# Altium project Gateway_Environmental_Sensor.PrjPcb
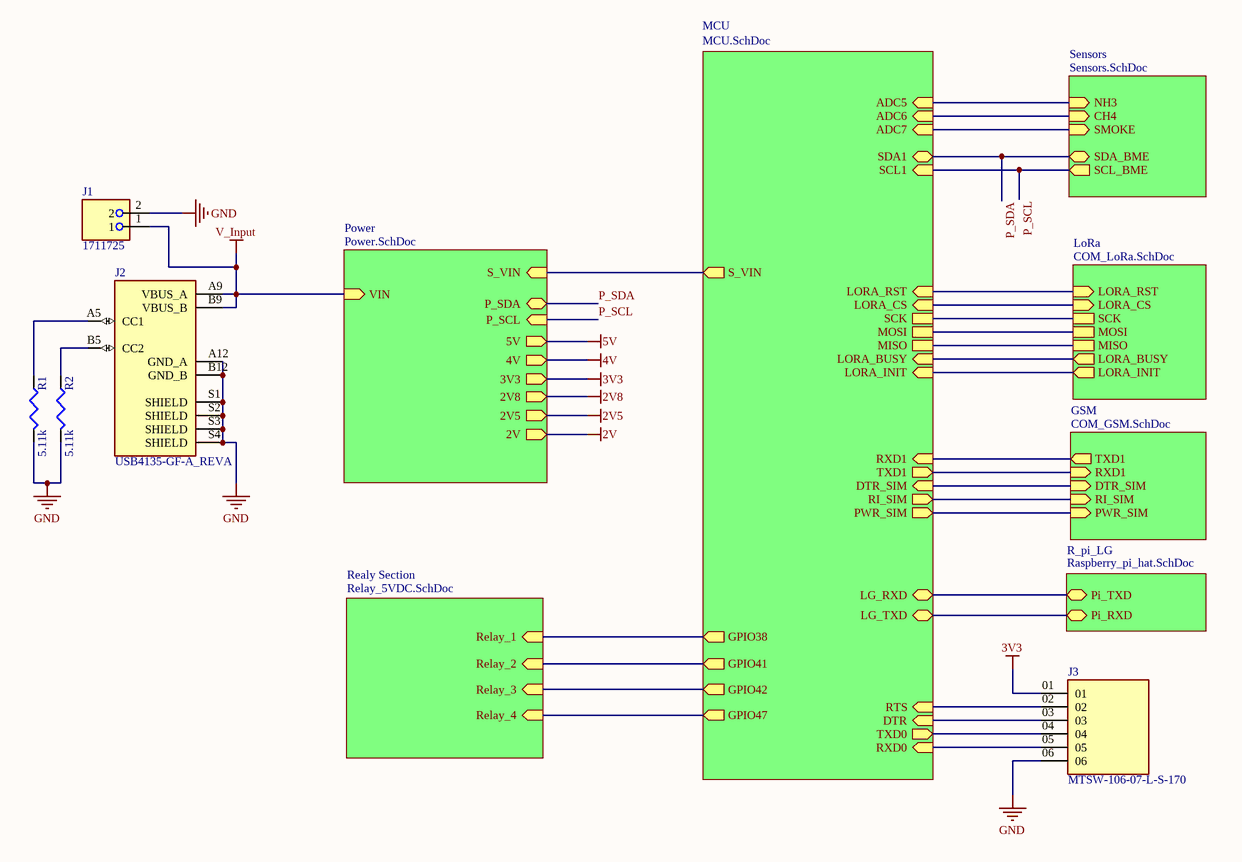
[diagram p0: TopSheet.SchDoc]
8 sheets, 147 parts. Net scope: hierarchical (ports join the sheet entries above them; power ports are global).
Board file: PCB1.PcbDoc
Sheets:
  TopSheet.SchDoc
    MCU = MCU.SchDoc
    Power = Power.SchDoc
    Sensors = Sensors.SchDoc
    LoRa = COM_LoRa.SchDoc
    GSM = COM_GSM.SchDoc
    R_pi_LG = Raspberry_pi_hat.SchDoc
    Realy Section = Relay_5VDC.SchDoc

## Sheet TopSheet.SchDoc
size 279 x 241 mm; SheetNumber: 1; SheetTotal: 8

### Parts
J1  1711725  [PHOENIX_1711725]
J2  USB4135-GF-A_REVA  [GCT_USB4135-GF-A_REVA]
J3  MTSW-106-07-L-S-170  [SAMTEC_MTSW-106-07-L-S-170]
R1  5.11k  [R0603]
R2  5.11k  [R0603]

### Sub-sheets
GSM = COM_GSM.SchDoc: TXD1 (out), RXD1 (in), DTR_SIM (in), RI_SIM (in), PWR_SIM (in)
LoRa = COM_LoRa.SchDoc: LORA_RST (in), LORA_CS (in), SCK, MOSI, MISO, LORA_BUSY (out), LORA_INIT (out)
MCU = MCU.SchDoc: ADC5 (in), ADC6 (in), ADC7 (in), SDA1 (bidir), SCL1 (in), LORA_RST (in), LORA_CS (in), SCK, MOSI, MISO, LORA_BUSY (in), LORA_INIT (in), RXD1 (in), TXD1 (out), DTR_SIM (in), RI_SIM (out), PWR_SIM (out), RTS (in), DTR (in), TXD0 (out), RXD0 (in), S_VIN (out), LG_TXD (bidir), LG_RXD (bidir), GPIO38 (out), GPIO41 (out), GPIO42 (out), GPIO47 (out)
Power = Power.SchDoc: P_SDA (bidir), P_SCL (in), 5V (out), 3V3 (out), 2V5 (out), 4V (out), 2V8 (out), 2V (out), VIN (in), S_VIN (in)
R_pi_LG = Raspberry_pi_hat.SchDoc: Pi_RXD (bidir), Pi_TXD (bidir)
Realy Section = Relay_5VDC.SchDoc: Relay_1 (in), Relay_2 (in), Relay_3 (in), Relay_4 (in)
Sensors = Sensors.SchDoc: NH3 (in), CH4 (in), SMOKE (in), SDA_BME (bidir), SCL_BME (out)

### Nets
3V3: J3.01 ; sheet Power/3V3
GND: J1.2 J2.A12(GND_A) J2.B12(GND_B) J2.S1(SHIELD) J2.S2(SHIELD) J2.S3(SHIELD) J2.S4(SHIELD) J3.06 R1.2 R2.2
V_Input: J1.1 J2.A9(VBUS_A) J2.B9(VBUS_B) ; sheet Power/VIN
P.06: sheet MCU/DTR_SIM, sheet GSM/DTR_SIM
P.07: sheet MCU/RI_SIM, sheet GSM/RI_SIM
P_SCL: sheet MCU/SCL1, sheet Power/P_SCL, sheet Sensors/SCL_BME
P_SDA: sheet MCU/SDA1, sheet Power/P_SDA, sheet Sensors/SDA_BME
RXD: sheet MCU/TXD1, sheet GSM/RXD1
TXD: sheet MCU/RXD1, sheet GSM/TXD1
NetJ2_A5: J2.A5(CC1) R1.1
NetJ2_B5: J2.B5(CC2) R2.1
NetJ3_02: J3.02 ; sheet MCU/RTS
NetJ3_03: J3.03 ; sheet MCU/DTR
NetJ3_04: J3.04 ; sheet MCU/TXD0
NetJ3_05: J3.05 ; sheet MCU/RXD0
NetJ11_8: sheet MCU/LG_RXD, sheet R_pi_LG/Pi_TXD
NetJ11_10: sheet MCU/LG_TXD, sheet R_pi_LG/Pi_RXD
NetR12_1: sheet MCU/S_VIN, sheet Power/S_VIN
NetR21_1: sheet MCU/ADC5, sheet Sensors/NH3
NetR22_1: sheet MCU/ADC6, sheet Sensors/CH4
NetR23_1: sheet MCU/ADC7, sheet Sensors/SMOKE
NetR27_1: sheet MCU/PWR_SIM, sheet GSM/PWR_SIM
NetR37_1: sheet MCU/GPIO38, sheet Realy Section/Relay_1
NetR39_1: sheet MCU/GPIO41, sheet Realy Section/Relay_2
NetR43_1: sheet MCU/GPIO42, sheet Realy Section/Relay_3
NetR47_1: sheet MCU/GPIO47, sheet Realy Section/Relay_4
NetU1_4: sheet MCU/LORA_INIT, sheet LoRa/LORA_INIT
NetU1_15: sheet MCU/LORA_BUSY, sheet LoRa/LORA_BUSY
NetU1_18: sheet MCU/LORA_CS, sheet LoRa/LORA_CS
NetU1_19: sheet MCU/MOSI, sheet LoRa/MOSI
NetU1_20: sheet MCU/SCK, sheet LoRa/SCK
NetU1_21: sheet MCU/MISO, sheet LoRa/MISO
NetU1_22: sheet MCU/LORA_RST, sheet LoRa/LORA_RST

### Library data of the parts
J1 = 1711725: PCB Terminal Screw 5.08mm 12AWG 400V 24A 2 Position COMBICON MKDS Series | Phoenix Contact 1711725; SnapEDA_Link: https://www.snapeda.com/parts/1711725/Phoenix+Contact/view-part/?ref=snap; Package: None; MF: Phoenix Contact; MP: 1711725; Check_prices: https://www.snapeda.com/parts/1711725/Phoenix+Contact/view-part/?ref=eda
J2 = USB4135-GF-A_REVA: Type C Receptacle, Horizontal, SMT, For Power Charging Only; MF: Global Connector Technology; SnapEDA_Link: https://www.snapeda.com/parts/USB4135-GF-A/Global+Connector+Technology/view-part/?ref=snap; Check_prices: https://www.snapeda.com/parts/USB4135-GF-A/Global+Connector+Technology/view-part/?ref=eda; Price: None; MP: USB4135-GF-A; Value: *; Purchase-URL: https://pricing.snapeda.com/search/part/USB4135-GF-A/?ref=eda; Availability: In Stock; Package: None
R1 R2 = Resistor: This Library provides a comprehensive set of schematic symbols and PCB footprints for standard resistor packages (e.g., 0402, 0603, 0805, 1206).
J3 = MTSW-106-07-L-S-170: Availability: Unavailable; Package: None; Price: None; MP: MTSW-106-07-L-S-170

## Sheet MCU.SchDoc
size 355 x 203 mm; SheetNumber: 2; SheetTotal: 8
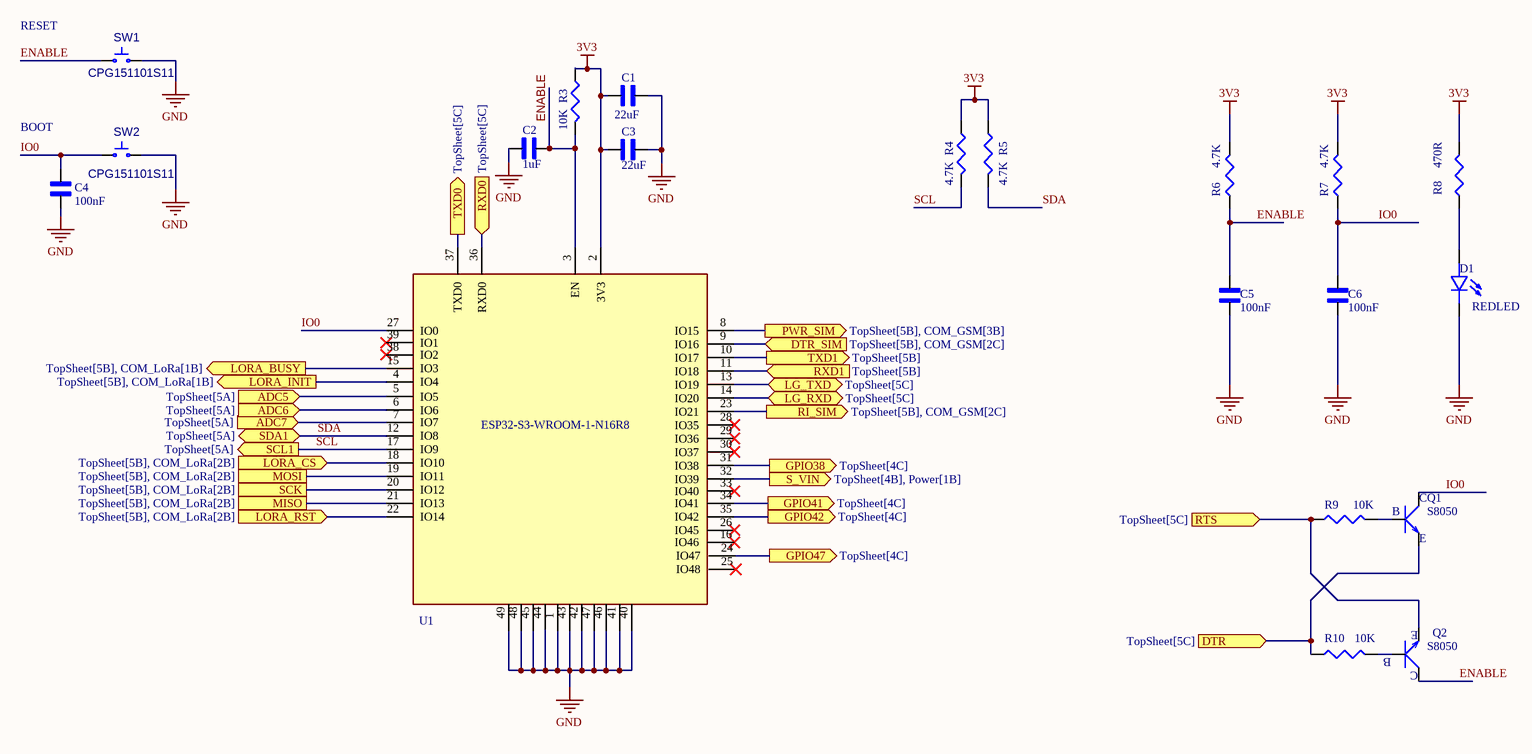
[diagram p1: MCU.SchDoc]

### Parts
C1  22uF  [C0603]
C2  1uF  [C0603]
C3  22uF  [C0603]
C4  100nF  [C0603]
C5  100nF  [C0603]
C6  100nF  [C0603]
D1  REDLED  [0603D-B]
Q1  S8050  [SOT95P237X112-3N]
Q2  S8050  [SOT95P237X112-3N]
R3  10K  [R0603]
R4  4.7K  [R0603]
R5  4.7K  [R0603]
R6  4.7K  [R0603]
R7  4.7K  [R0603]
R8  470R  [R0603]
R9  10K  [R0603]
R10  10K  [R0603]
SW1  CPG151101S11  [5.2 mm × 5.2 mm SW]
SW2  CPG151101S11  [5.2 mm × 5.2 mm SW]
U1  ESP32-S3-WROOM-1-N16R8  [ESP32S3WROOM1N8R2]

### Ports
ADC5 (in, see TopSheet[5A]), ADC6 (in, see TopSheet[5A]), ADC7 (in, see TopSheet[5A]), DTR (in, see TopSheet[5C]), DTR_SIM (in, see TopSheet[5B], COM_GSM[2C]), GPIO38 (out, see TopSheet[4C]), GPIO41 (out, see TopSheet[4C]), GPIO42 (out, see TopSheet[4C]), GPIO47 (out, see TopSheet[4C]), LG_RXD (bidir, see TopSheet[5C]), LG_TXD (bidir, see TopSheet[5C]), LORA_BUSY (out, see TopSheet[5B], COM_LoRa[1B]), LORA_CS (in, see TopSheet[5B], COM_LoRa[2B]), LORA_INIT (out, see TopSheet[5B], COM_LoRa[1B]), LORA_RST (in, see TopSheet[5B], COM_LoRa[2B]), MISO (see TopSheet[5B], COM_LoRa[2B]), MOSI (see TopSheet[5B], COM_LoRa[2B]), PWR_SIM (out, see TopSheet[5B], COM_GSM[3B]), RI_SIM (out, see TopSheet[5B], COM_GSM[2C]), RTS (in, see TopSheet[5C]), RXD0 (in, see TopSheet[5C]), RXD1 (in, see TopSheet[5B]), S_VIN (out, see TopSheet[4B], Power[1B]), SCK (see TopSheet[5B], COM_LoRa[2B]), SCL1 (out, see TopSheet[5A]), SDA1 (bidir, see TopSheet[5A]), TXD0 (out, see TopSheet[5C]), TXD1 (out, see TopSheet[5B])

### Nets
3V3: C1.1 C3.1 R3.1 R4.1 R5.1 R6.2 R7.2 R8.2 U1.2(3V3)
GND: C1.2 C2.1 C3.2 C4.1 C5.2 C6.2 D1.2(NEG) SW1.2 SW2.2
ENABLE: C2.2 C5.1 Q2.3(C) R3.2 R6.1 SW1.1 U1.3(EN)
IO0: C4.2 C6.1 Q1.3(C) R7.1 SW2.1 U1.27(IO0)
P.06: U1.9(IO16) ; port DTR_SIM
P.07: U1.23(IO21) ; port RI_SIM
RXD: U1.10(IO17) ; port TXD1
SCL: R4.2 U1.17(IO9) ; port SCL1  [project net P_SCL]
SDA: R5.2 U1.12(IO8) ; port SDA1  [project net P_SDA]
TXD: U1.11(IO18) ; port RXD1
NetD1_1: D1.1(POS) R8.1
NetJ3_02: Q2.2(E) R9.1 ; port RTS
NetJ3_03: Q1.2(E) R10.1 ; port DTR
NetJ3_04: U1.37(TXD0) ; port TXD0
NetJ3_05: U1.36(RXD0) ; port RXD0
NetJ11_8: U1.14(IO20) ; port LG_RXD
NetJ11_10: U1.13(IO19) ; port LG_TXD
NetQ1_1: Q1.1(B) R9.2
NetQ2_1: Q2.1(B) R10.2
NetR12_1: U1.32(IO39) ; port S_VIN
NetR21_1: U1.5(IO5) ; port ADC5
NetR22_1: U1.6(IO6) ; port ADC6
NetR23_1: U1.7(IO7) ; port ADC7
NetR27_1: U1.8(IO15) ; port PWR_SIM
NetR37_1: U1.31(IO38) ; port GPIO38
NetR39_1: U1.34(IO41) ; port GPIO41
NetR43_1: U1.35(IO42) ; port GPIO42
NetR47_1: U1.24(IO47) ; port GPIO47
NetU1_4: U1.4(IO4) ; port LORA_INIT
NetU1_15: U1.15(IO3) ; port LORA_BUSY
NetU1_18: U1.18(IO10) ; port LORA_CS
NetU1_19: U1.19(IO11) ; port MOSI
NetU1_20: U1.20(IO12) ; port SCK
NetU1_21: U1.21(IO13) ; port MISO
NetU1_22: U1.22(IO14) ; port LORA_RST

Not connected (* = marked no-connect by the designer): U1 1(GND) 16(IO46)* 25(IO48)* 26(IO45)* 28(IO35)* 29(IO36)* 30(IO37)* 33(IO40)* 38(IO2)* 39(IO1)* 40(GND) 41(GND) 42(GND) 43(GND) 44(GND) 45(GND) 46(GND) 47(GND) 48(GND) 49(GND)

### Notes on the sheet
- RESET
- BOOT

### Library data of the parts
C1-C6 = Capacitor non polar: This Non-Polarized Capacitor Design Library provides accurate schematic symbols and IPC-compliant PCB footprints for standard non-polarized capacitors, including MLCCs (ceramic capacitors) in common SMD sizes like 0402, 0603, 0805,1206 and 1210.; MF: Murata; MP: GJM1555C1HR10BB01J; SnapEDA_Link: https://www.snapeda.com/parts/GJM1555C1HR10BB01J/Murata/view-part/?ref=snap; Package: 1005 Taiyo Yuden; Check_prices: https://www.snapeda.com/parts/GJM1555C1HR10BB01J/Murata/view-part/?ref=eda
  C1 C3: VALUE: 22uF
  C2: VALUE: 1uF
  C4-C6: VALUE: 100nF
D1 = LED: Generic LED SMD; MF: Osram; MP: LHN974 RED LED 1206; SnapEDA_Link: https://www.snapeda.com/parts/LHN974%20RED%20LED%201206/Osram/view-part/?ref=snap; Package: None; Value: *; Check_prices: https://www.snapeda.com/parts/LHN974%20RED%20LED%201206/Osram/view-part/?ref=eda
Q1 Q2 = S8050: Bipolar (BJT) Transistor NPN 25 V 500 mA 150MHz 300 mW Surface Mount SOT-23; MF: UMW; Purchase-URL: https://pricing.snapeda.com/search/part/S8050/?ref=eda; Check_prices: https://www.snapeda.com/parts/S8050/Umwelt+Sensor+Teknik/view-part/?ref=eda; SnapEDA_Link: https://www.snapeda.com/parts/S8050/Umwelt+Sensor+Teknik/view-part/?ref=snap; Price: None; Availability: In Stock; Package: None; MP: S8050; Value: *
R3-R10 = Resistor: as R1 on sheet TopSheet
SW1 SW2 = Switch: Manufacturer Part Number: CPG151101S11; Supplier 3: LCSC; Supplier Part Number 3: C41430893
U1 = ESP32-S3-WROOM-1-N16R8: Bluetooth, WiFi 802.11b/g/n, Bluetooth v5.0 Transceiver Module 2.4GHz PCB Trace Surface Mount

## Sheet Power.SchDoc
size 381 x 241 mm; SheetNumber: 3; SheetTotal: 8
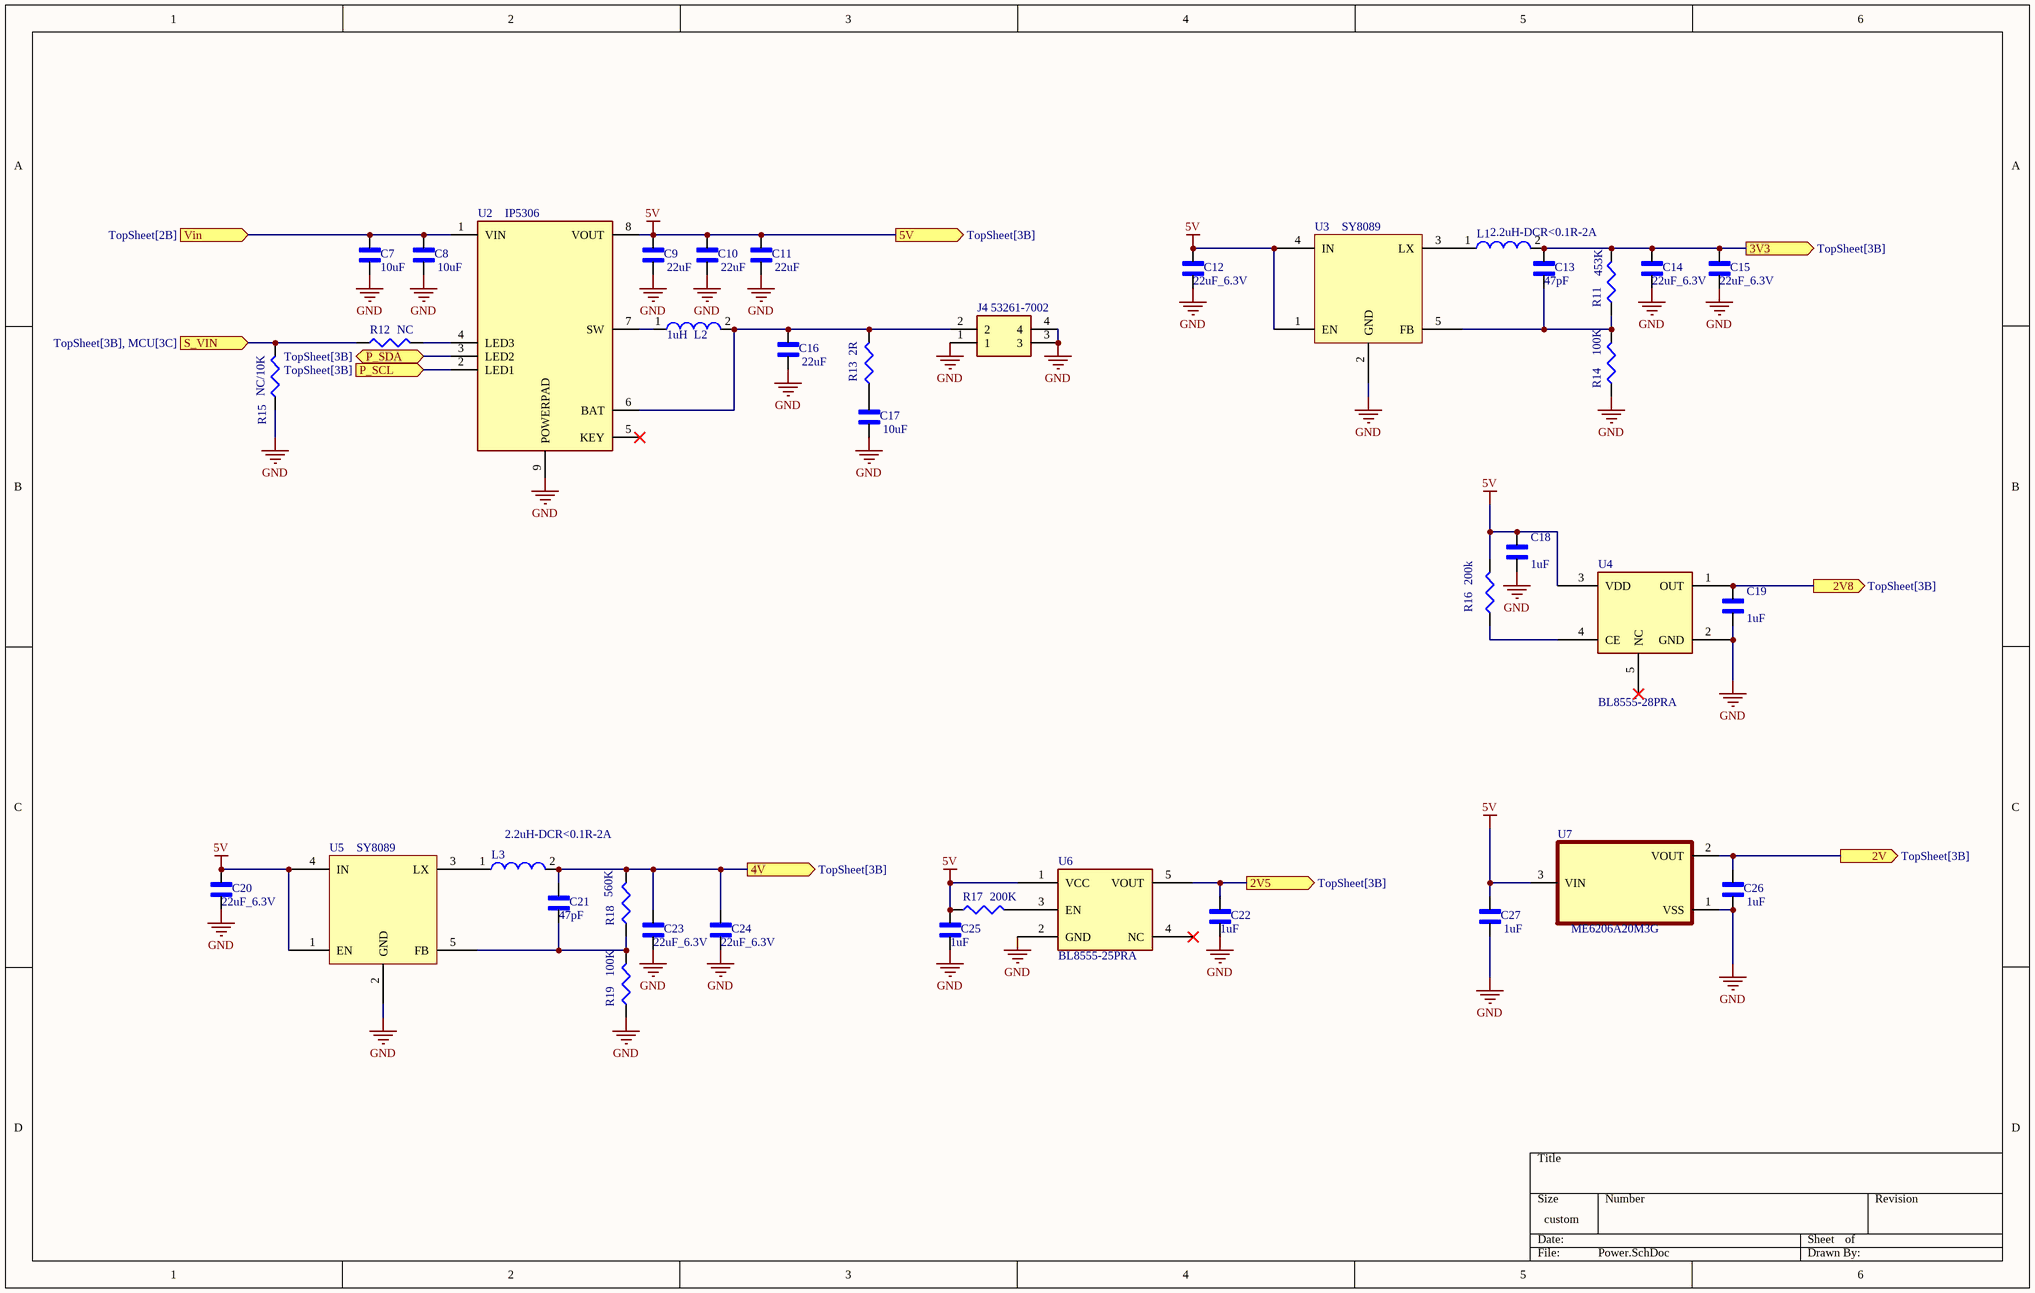
[diagram p2: Power.SchDoc]

### Parts
C7  10uF  [C0805]
C8  10uF  [C0805]
C9  22uF  [C0805]
C10  22uF  [C0805]
C11  22uF  [C0805]
C12  22uF_6.3V  [C0805]
C13  47pF  [C0603]
C14  22uF_6.3V  [C0805]
C15  22uF_6.3V  [C0805]
C16  22uF  [C0805]
C17  10uF  [C0805]
C18  1uF  [C0603]
C19  1uF  [C0603]
C20  22uF_6.3V  [C0805]
C21  47pF  [C0603]
C22  1uF  [C0805]
C23  22uF_6.3V  [C0805]
C24  22uF_6.3V  [C0805]
C25  1uF  [C0805]
C26  1uF  [C0603]
C27  1uF  [C0603]
J4  53261-7002  [532617002]
L1  2.2uH-DCR<0.1R-2A  [4.0 mm × 4.0 mm]
L2  1uH  [4.0 mm × 4.0 mm]
L3  2.2uH-DCR<0.1R-2A  [4.0 mm × 4.0 mm]
R11  453K  [R0603]
R12  NC  [R0603]
R13  2R  [R0805]
R14  100K  [R0603]
R15  NC/10K  [R0603]
R16  200k  [R0603]
R17  200K  [R0603]
R18  560K  [R0603]
R19  100K  [R0603]
U2  IP5306  [SOP127P600X165-9N]
U3  SY8089  [SOT95P280X145-5N]
U4  BL8555-28PRA  [TSOT-23_S5]
U5  SY8089  [SOT95P280X145-5N]
U6  BL8555-25PRA  [TSOT-23_S5]
U7  ME6206A20M3G  [SOT95P237X112-3N]

### Ports
2V5 (out, see TopSheet[3B]), 2V8 (out, see TopSheet[3B]), 2V (out, see TopSheet[3B]), 3V3 (out, see TopSheet[3B]), 4V (out, see TopSheet[3B]), 5V (out, see TopSheet[3B]), P_SCL (in, see TopSheet[3B]), P_SDA (bidir, see TopSheet[3B]), S_VIN (in, see TopSheet[3B], MCU[3C]), Vin (in, see TopSheet[2B])

### Nets
2V: C26.2 U7.2(VOUT) ; port 2V
2V5: C22.2 U6.5(VOUT) ; port 2V5
2V8: C19.2 U4.1(OUT) ; port 2V8
3V3: C13.2 C14.2 C15.2 L1.2 R11.2 ; port 3V3
4V: C21.2 C23.2 C24.2 L3.2 R18.2 ; port 4V
5V: C9.2 C10.2 C11.2 C12.2 C18.2 C20.2 C25.2 C27.2 R16.2 R17.1 U2.8(VOUT) U3.1(EN) U3.4(IN) U4.3(VDD) U5.1(EN) U5.4(IN) U6.1(VCC) U7.3(VIN) ; port 5V
GND: C7.1 C8.1 C9.1 C10.1 C11.1 C12.1 C14.1 C15.1 C16.1 C17.1 C18.1 C19.1 C20.1 C22.1 C23.1 C24.1 C25.1 C26.1 C27.1 J4.1 J4.3 J4.4 R14.1 R15.1 R19.1 U2.9(POWERPAD) U3.2(GND) U4.2(GND) U5.2(GND) U6.2(GND) U7.1(VSS)
V_Input: C7.2 C8.2 U2.1(VIN) ; port Vin
P_SCL: U2.2(LED1) ; port P_SCL
P_SDA: U2.3(LED2) ; port P_SDA
NetC13_1: C13.1 R11.1 R14.2 U3.5(FB)
NetC16_2: C16.2 J4.2 L2.2 R13.2 U2.6(BAT)
NetC17_2: C17.2 R13.1
NetC21_1: C21.1 R18.1 R19.2 U5.5(FB)
NetL1_1: L1.1 U3.3(LX)
NetL2_1: L2.1 U2.7(SW)
NetL3_1: L3.1 U5.3(LX)
NetR12_1: R12.1 R15.2 ; port S_VIN
NetR12_2: R12.2 U2.4(LED3)
NetR16_1: R16.1 U4.4(CE)
NetR17_2: R17.2 U6.3(EN)

Not connected (* = marked no-connect by the designer): U2 5(KEY)*; U4 5(NC)*; U6 4(NC)*

### Library data of the parts
C7-C27 = Capacitor non polar: as C1 on sheet MCU; SnapEDA_Link: https://www.snapeda.com/parts/GJM1555C1HR10BB01J/Murata/view-part/?ref=snap; Package: 1005 Taiyo Yuden; Check_prices: https://www.snapeda.com/parts/GJM1555C1HR10BB01J/Murata/view-part/?ref=eda
  C7 C8 C17: VALUE: 10uF
  C9-C11 C16: VALUE: 22uF
  C12 C14 C15 C20 C23 C24: VALUE: 22uF_6.3V
  C13 C21: VALUE: 47pF
  C18 C19 C22 C25-C27: VALUE: 1uF
J4 = 53261-7002: Headers & Wire Housings PicoBlade SMT RA PKG 0.38 GOLD 2P; Manufacturer_Name: Molex; Geometry.Height: 3.4mm; Mouser Part Number: 538-53261-7002; Mouser Price/Stock: https://www.mouser.co.uk/ProductDetail/Molex/53261-7002?qs=0lSvoLzn4L%2F9TYfu1Dmicg%3D%3D; Manufacturer_Part_Number: 53261-7002; Datasheet Link: https://www.molex.com/pdm_docs/sd/532617002_sd.pdf
L1-L3 = Inductor: SMD Inductor Generic; PartNumber: 744043152; Inductance: 1500 µH; DatasheetVersion: ver 6, Aug-2010; PackageReference: WE-TPC-4828-MH; PackageDescription: SMD Inductor, 2-Leads, Body 4.8 x 4.8 mm; ComponentLink1Description: Manufacturer URL; ComponentLink1URL: http://www.we-online.com; ComponentLink2Description: Datasheet; ComponentLink2URL: http://www.we-online.de/katalog/media/pdf/744043152.pdf
R11-R19 = Resistor: as R1 on sheet TopSheet
U2 = IP5306: Fully-Integrated Power Bank System-On-Chip with 2.1A charger, 2.4A discharger; MF: Injoinic; SnapEDA_Link: https://www.snapeda.com/parts/IP5306/Injoinic/view-part/?ref=snap; Package: SOIC-4 INJOINIC; Value: *; MP: IP5306; Check_prices: https://www.snapeda.com/parts/IP5306/Injoinic/view-part/?ref=eda
U3 U5 = SY8089A1
U4 = BL8555-28PRA: BL8555-28PRA   2.8 V regulator; MF: Analog Devices; MP: LT1722CS5#TRMPBF; SnapEDA_Link: https://www.snapeda.com/parts/LT1722CS5%23TRMPBF/Analog+Devices/view-part/?ref=snap; Package: SOT-5 Analog Devices; Value: *; Check_prices: https://www.snapeda.com/parts/LT1722CS5%23TRMPBF/Analog+Devices/view-part/?ref=eda
U6 = BL8555-25PRA: BL8555-25PRA   2.5 V regulator; MF: Analog Devices; MP: LT1722CS5#TRMPBF; SnapEDA_Link: https://www.snapeda.com/parts/LT1722CS5%23TRMPBF/Analog+Devices/view-part/?ref=snap; Package: SOT-5 Analog Devices; Value: *; Check_prices: https://www.snapeda.com/parts/LT1722CS5%23TRMPBF/Analog+Devices/view-part/?ref=eda
U7 = ME6206A20M3G: 2V regulator MICRONE(Nanjing Micro One Elec) ME6206A20M3G; MF: Analog Devices; MP: MAX6006BEUR+T; SnapEDA_Link: https://www.snapeda.com/parts/MAX6006BEUR+T/Analog+Devices/view-part/?ref=snap; Package: SOT-23-3 Maxim Integrated; Value: *; Check_prices: https://www.snapeda.com/parts/MAX6006BEUR+T/Analog+Devices/view-part/?ref=eda

## Sheet Sensors.SchDoc
size 423 x 119 mm; SheetNumber: 4; SheetTotal: 8
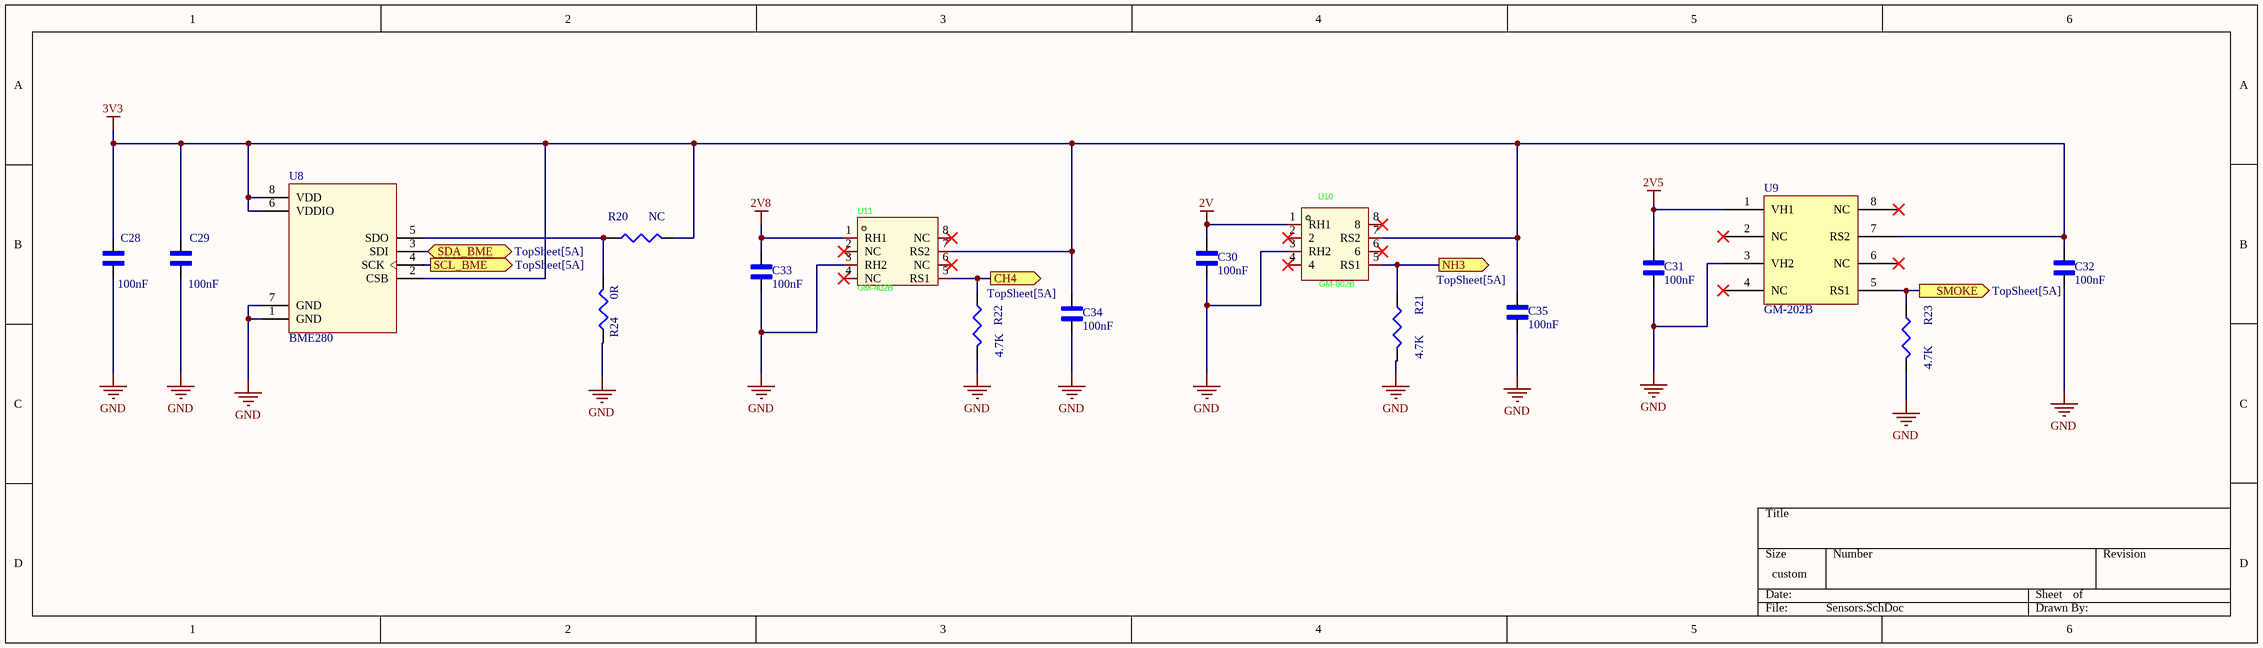
[diagram p3: Sensors.SchDoc]

### Parts
C28  100nF  [C0603]
C29  100nF  [C0603]
C30  100nF  [C0603]
C31  100nF  [C0603]
C32  100nF  [C0603]
C33  100nF  [C0603]
C34  100nF  [C0603]
C35  100nF  [C0603]
R20  NC  [R0603]
R21  4.7K  [R0603]
R22  4.7K  [R0603]
R23  4.7K  [R0603]
R24  0R  [R0603]
U8  BME280  [PSON65P250X250X100-8N]
U9  GM-202B  [LCC-8_L5.0-W5.0-P1.27-BL]
U10  GM-802B  [LCC-8_L5.0-W5.0-P1.27-BL]
U11  GM-402B  [SENSORS-SMD_GM-402B]

### Ports
CH4 (out, see TopSheet[5A]), NH3 (out, see TopSheet[5A]), SCL_BME (out, see TopSheet[5A]), SDA_BME (bidir, see TopSheet[5A]), SMOKE (out, see TopSheet[5A])

### Nets
2V: C30.2 U10.1(RH1)
2V5: C31.2 U9.1(VH1)
2V8: C33.2 U11.1(RH1)
3V3: C28.2 C29.2 C32.2 C34.2 C35.2 R20.2 U8.2(CSB) U8.6(VDDIO) U8.8(VDD) U9.7(RS2) U10.7(RS2) U11.7(RS2)
GND: C28.1 C29.1 C30.1 C31.1 C32.1 C33.1 C34.1 C35.1 R21.2 R22.2 R23.2 R24.1 U8.1(GND) U8.7(GND) U9.3(VH2) U10.3(RH2) U11.3(RH2)
P_SCL: U8.4(SCK) ; port SCL_BME
P_SDA: U8.3(SDI) ; port SDA_BME
NetR20_1: R20.1 R24.2 U8.5(SDO)
NetR21_1: R21.1 U10.5(RS1) ; port NH3
NetR22_1: R22.1 U11.5(RS1) ; port CH4
NetR23_1: R23.1 U9.5(RS1) ; port SMOKE

Not connected (* = marked no-connect by the designer): U9 2(NC)* 4(NC)* 6(NC)* 8(NC)*; U10 2* 4* 6* 8*; U11 2(NC)* 4(NC)* 6(NC)* 8(NC)*

### Library data of the parts
C28-C35 = Capacitor non polar: as C1 on sheet MCU; SnapEDA_Link: https://www.snapeda.com/parts/GJM1555C1HR10BB01J/Murata/view-part/?ref=snap; Package: 1005 Taiyo Yuden; VALUE: 100nF; Check_prices: https://www.snapeda.com/parts/GJM1555C1HR10BB01J/Murata/view-part/?ref=eda
R20-R24 = Resistor: as R1 on sheet TopSheet
U8 = BME280: DIGITAL HUMIDITY, PRESSURE AND TEMPERATURE SENSOR<br>* Digital interface IÂ²C (up to 3.4 MHz) and SPI (3 and 4 wire, up to 10 MHz)* Supply voltage VDD main supply voltage range: 1.71 V to 3.6 V*VDDIO interface voltage range: 1.2 V to 3.6 V<br> Operating range -40â€¦+85 Â°C, 0â€¦100 % rel. humidity, 300â€¦1100 hPa <br><br>  The library has been designed by<a href="https://www.facebook.com/groups/eaglecadsoftUK"> Richard Magdycz</a>; Package: None; Availability: Unavailable; MP: BME280; Value: *; Price: None
U9 = GM-202B: Smoke Sensor winson
U10 = GM-802B_1: Pin Configuration: / Winsen Electronics / Pin 1 (RH1): Heater terminal 1 / winsen-sensor.com / Pin 2: Not connected / Pin 3 (RH2): Heater terminal 2 / Pin 4: Not connected / Winsen Electronics / Pin 5 (RS1): Sensor output terminal 1 (signal) / Pin 6: Not connected / Pin 7 (RS2): Sensor output terminal 2 (signal) / Pin 8: Not connected; Add into BOM: yes; Symbol: GM-802B; Device: GM-802B; LCSC Part Name: GM-802B; Supplier Part: C9900008830; Manufacturer Part: GM-802B; Supplier Footprint: LCC-8_L5.0-W5.0-P1.27; JLCPCB Part Class: Extended Part; Supplier: LCSC; Convert to PCB: yes
U11 = GM-402B: The GM-402B is a compact MEMS-based combustible gas sensor by Winsen Electronics, designed to detect gases like methane (CH₄) and propane (C₃H₈) within a 1–10,000 ppm range. The sensor features an 8-pin SMD package with the following; Manufacturer: Winsen(炜盛); Add into BOM: yes; Symbol: GM-402B; Device: GM-402B; LCSC Part Name: 可燃气体传感器; Supplier Part: C99754; Manufacturer Part: GM-402B; Supplier Footprint: SMD-8P,5x5mm; JLCPCB Part Class: Extended Part; Datasheet: https://atta.szlcsc.com/upload/public/pdf/source/20170413/1492062922238.pdf; Supplier: LCSC; Convert to PCB: yes

## Sheet COM_LoRa.SchDoc
size A; SheetNumber: 5; SheetTotal: 8
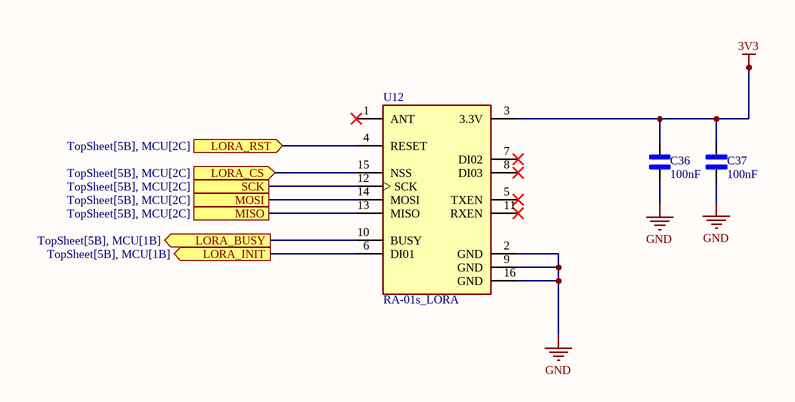
[diagram p4: COM_LoRa.SchDoc]

### Parts
C36  100nF  [C0603]
C37  100nF  [C0603]
U12  RA-01s_LORA  [MODULE_RA-01s_LORA]

### Ports
LORA_BUSY (out, see TopSheet[5B], MCU[1B]), LORA_CS (in, see TopSheet[5B], MCU[2C]), LORA_INIT (out, see TopSheet[5B], MCU[1B]), LORA_RST (in, see TopSheet[5B], MCU[2C]), MISO (see TopSheet[5B], MCU[2C]), MOSI (see TopSheet[5B], MCU[2C]), SCK (see TopSheet[5B], MCU[2C])

### Nets
3V3: C36.2 C37.2 U12.3(3.3V)
GND: C36.1 C37.1 U12.2(GND) U12.9(GND) U12.16(GND)
NetU1_4: U12.6(DI01) ; port LORA_INIT
NetU1_15: U12.10(BUSY) ; port LORA_BUSY
NetU1_18: U12.15(NSS) ; port LORA_CS
NetU1_19: U12.14(MOSI) ; port MOSI
NetU1_20: U12.12(SCK) ; port SCK
NetU1_21: U12.13(MISO) ; port MISO
NetU1_22: U12.4(RESET) ; port LORA_RST

Not connected (* = marked no-connect by the designer): U12 1(ANT)* 5(TXEN)* 7(DI02)* 8(DI03)* 11(RXEN)*

### Library data of the parts
C36 C37 = Capacitor non polar: as C1 on sheet MCU; SnapEDA_Link: https://www.snapeda.com/parts/GJM1555C1HR10BB01J/Murata/view-part/?ref=snap; Package: 1005 Taiyo Yuden; Value: *; Check_prices: https://www.snapeda.com/parts/GJM1555C1HR10BB01J/Murata/view-part/?ref=eda
U12 = RA-01s_LORA: Ra-02 LoRa RF M5Stack Platform Evaluation Expansion Board; MP: RA-02_LORA; Package: None; Availability: Unavailable; Value: *; Price: None

## Sheet COM_GSM.SchDoc
size 330 x 241 mm; SheetNumber: 6; SheetTotal: 8
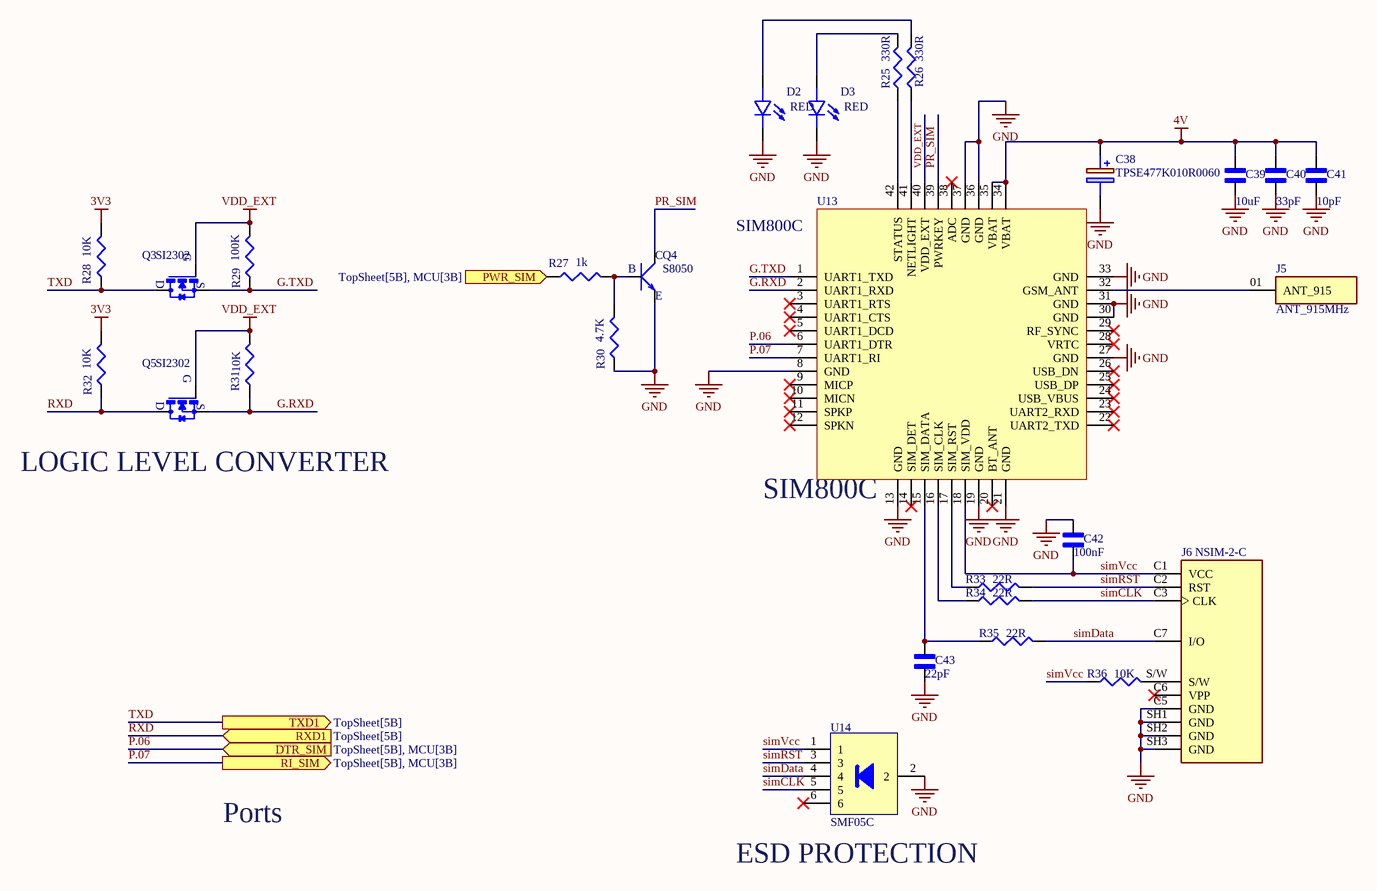
[diagram p5: COM_GSM.SchDoc]

### Parts
C38  TPSE477K010R0060  [CAPPM7344X430N]
C39  10uF  [C0603]
C40  33pF  [C0603]
C41  10pF  [C0603]
C42  100nF  [C0402]
C43  22pF  [C0402]
D2  RED  [0603D-B]
D3  RED  [0603D-B]
J5  ANT_915MHz  [SAMTEC_HTSW-101-24-LM-S]
J6  NSIM-2-C  [CUI_NSIM-2-C]
Q3  SI2302  [SOT23]
Q4  S8050  [SOT95P237X112-3N]
Q5  SI2302  [SOT23]
R25  330R  [R0603]
R26  330R  [R0603]
R27  1k  [R0603]
R28  10K  [R0603]
R29  100K  [R0603]
R30  4.7K  [R0603]
R31  10K  [R0603]
R32  10K  [R0603]
R33  22R  [R0402]
R34  22R  [R0402]
R35  22R  [R0402]
R36  10K  [R0402]
U13  DeviceName: SIM800C  [SMD]  (hidden comment: SIM800C GSM/GPRS Module)
U14  SOT363  [SOT363]  (value not drawn)

### Ports
DTR_SIM (in, see TopSheet[5B], MCU[3B]), PWR_SIM (in, see TopSheet[5B], MCU[3B]), RI_SIM (out, see TopSheet[5B], MCU[3B]), RXD1 (in, see TopSheet[5B]), TXD1 (out, see TopSheet[5B])

### Nets
3V3: R28.2 R32.2
4V: C38.1(+) C39.2 C40.2 C41.2 U13.34(VBAT) U13.35(VBAT)
GND: C38.2(-) C39.1 C40.1 C41.1 C42.2 C43.1 D2.2(NEG) D3.2(NEG) J6.C5(GND) J6.SH1(GND) J6.SH2(GND) J6.SH3(GND) Q4.2(E) R30.1 U13.8(GND) U13.13(GND) U13.19(GND) U13.21(GND) U13.27(GND) U13.30(GND) U13.31(GND) U13.33(GND) U13.36(GND) U13.37(GND) U14.2
VDD_EXT: Q3.1(G) Q5.1(G) R29.2 R31.2 U13.40(VDD_EXT)
G.RXD: Q5.2(S) R31.1 U13.2(UART1_RXD)
G.TXD: Q3.2(S) R29.1 U13.1(UART1_TXD)
P.06: U13.6(UART1_DTR) ; port DTR_SIM
P.07: U13.7(UART1_RI) ; port RI_SIM
PR_SIM: Q4.3(C) U13.39(PWRKEY)
RXD: Q5.3(D) R32.1 ; port RXD1
simCLK: J6.C3(CLK) R34.2 U14.5
simData: J6.C7(I/O) R35.2 U14.4
simRST: J6.C2(RST) R33.2 U14.3
simVcc: C42.1 J6.C1(VCC) R36.1 U13.18(SIM_VDD) U14.1
TXD: Q3.3(D) R28.1 ; port TXD1
NetC43_2: C43.2 R35.1 U13.15(SIM_DATA)
NetD2_1: D2.1(POS) R26.2
NetD3_1: D3.1(POS) R25.2
NetJ5_01: J5.01(ANT_915) U13.32(GSM_ANT)
NetJ6_S/W: J6.S/W R36.2
NetQ4_1: Q4.1(B) R27.2 R30.2
NetR25_1: R25.1 U13.42(STATUS)
NetR26_1: R26.1 U13.41(NETLIGHT)
NetR27_1: R27.1 ; port PWR_SIM
NetR33_1: R33.1 U13.17(SIM_RST)
NetR34_1: R34.1 U13.16(SIM_CLK)

Not connected (* = marked no-connect by the designer): J6 C6(VPP)*; U13 3(UART1_RTS)* 4(UART1_CTS)* 5(UART1_DCD)* 9(MICP)* 10(MICN)* 11(SPKP)* 12(SPKN)* 14(SIM_DET)* 20(BT_ANT)* 22(UART2_TXD)* 23(UART2_RXD)* 24(USB_VBUS)* 25(USB_DP)* 26(USB_DN)* 28(VRTC)* 29(RF_SYNC)* 38(ADC)*; U14 6*

### Notes on the sheet
- (near Q5) LOGIC LEVEL CONVERTER
- (near U13) SIM800C
- Ports
- (near U14) ESD PROTECTION
- (near U14) SMF05C

### Library data of the parts
C38 = TPSE477K010R0060: Capacitor tantalum TPS 2717 470uF 10V AVX +/-10% 470uF 10 V dc SMD Tantalum Electrolytic Capacitor, 7343-43 ESR 60m +125C TPS; Manufacturer_Name: Kyocera AVX; Geometry.Height: 4.3mm; Mouser Part Number: 581-TPSE477K010R0060; Mouser Price/Stock: https://www.mouser.com/Search/Refine.aspx?Keyword=581-TPSE477K010R0060; Manufacturer_Part_Number: TPSE477K010R0060; Datasheet Link: https://componentsearchengine.com/Datasheets/1/TPSE477K010R0060.pdf
C39-C43 = Capacitor non polar: as C1 on sheet MCU; SnapEDA_Link: https://www.snapeda.com/parts/GJM1555C1HR10BB01J/Murata/view-part/?ref=snap; Package: 1005 Taiyo Yuden; Value: *; Check_prices: https://www.snapeda.com/parts/GJM1555C1HR10BB01J/Murata/view-part/?ref=eda
D2 D3 = LED: as D1 on sheet MCU; SnapEDA_Link: https://www.snapeda.com/parts/LHN974%20RED%20LED%201206/Osram/view-part/?ref=snap; Package: None; Value: *; Check_prices: https://www.snapeda.com/parts/LHN974%20RED%20LED%201206/Osram/view-part/?ref=eda
J5 = ANT_915MHz: MP: HTSW-101-24-LM-S; Availability: Unavailable; Package: None; Price: None; Value: *
J6 = NSIM-2-C: Nano SIM Card Connectors, 6 Positions, Connector, Hinged, Surface Mount, 1.4 mm Height Above Board, Gold Flash; MF: Same Sky; SnapEDA_Link: https://www.snapeda.com/parts/NSIM-2-C/Same+Sky/view-part/?ref=snap; Package: None; Value: *; MP: NSIM-2-C; Check_prices: https://www.snapeda.com/parts/NSIM-2-C/Same+Sky/view-part/?ref=eda
Q3 Q5 = SI2302: N-Channel 20 V 2.6A (Ta) 710mW (Ta) Surface Mount SOT-23-3 (TO-236); MF: Vishay Siliconix; SnapEDA_Link: https://www.snapeda.com/parts/SI2302/Vishay/view-part/?ref=snap; Package: SOT-23-3 Vishay Siliconix; Value: *; MP: SI2302; Check_prices: https://www.snapeda.com/parts/SI2302/Vishay/view-part/?ref=eda
Q4 = S8050: as Q1 on sheet MCU; Purchase-URL: https://pricing.snapeda.com/search/part/S8050/?ref=eda; Check_prices: https://www.snapeda.com/parts/S8050/Umwelt+Sensor+Teknik/view-part/?ref=eda; SnapEDA_Link: https://www.snapeda.com/parts/S8050/Umwelt+Sensor+Teknik/view-part/?ref=snap; Price: None; Availability: In Stock; Package: None; MP: S8050; Value: *
R25-R36 = Resistor: as R1 on sheet TopSheet
U13 = GSM_SIM800C: GateName_1: G$1; SymbolName_1: SIM900_LITERAL; DeviceSetName: GSM_SIM900_LITERAL; LibraryName: microbuilder; Package: SIM900_SMT; Parameter 1: *
U14 = SMF05C: GateName_1: G$1; SymbolName_1: TVSARRAY_5LANE; LibraryName: microbuilder; DeviceSetName: TVSARRAY_5LANE; Package: SOT363

## Sheet Raspberry_pi_hat.SchDoc
size A; SheetNumber: 7; SheetTotal: 8
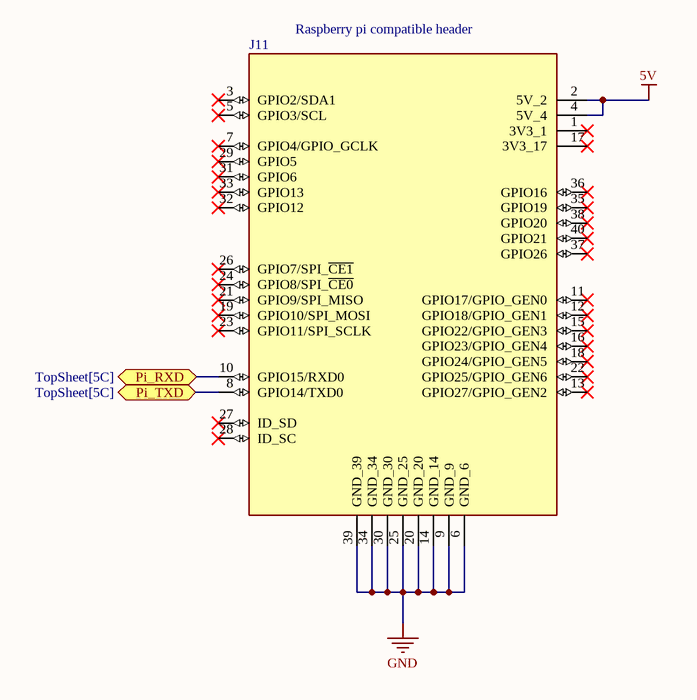
[diagram p6: Raspberry_pi_hat.SchDoc]

### Parts
J11  Raspberry pi compatible header  [pi_header]

### Ports
Pi_RXD (bidir, see TopSheet[5C]), Pi_TXD (bidir, see TopSheet[5C])

### Nets
5V: J11.2(5V_2) J11.4(5V_4)
GND: J11.6(GND_6) J11.9(GND_9) J11.14(GND_14) J11.20(GND_20) J11.25(GND_25) J11.30(GND_30) J11.34(GND_34) J11.39(GND_39)
NetJ11_8: J11.8(GPIO14/TXD0) ; port Pi_TXD
NetJ11_10: J11.10(GPIO15/RXD0) ; port Pi_RXD

Not connected (* = marked no-connect by the designer): J11 1(3V3_1)* 3(GPIO2/SDA1)* 5(GPIO3/SCL)* 7(GPIO4/GPIO_GCLK)* 11(GPIO17/GPIO_GEN0)* 12(GPIO18/GPIO_GEN1)* 13(GPIO27/GPIO_GEN2)* 15(GPIO22/GPIO_GEN3)* 16(GPIO23/GPIO_GEN4)* 17(3V3_17)* 18(GPIO24/GPIO_GEN5)* 19(GPIO10/SPI_MOSI)* 21(GPIO9/SPI_MISO)* 22(GPIO25/GPIO_GEN6)* 23(GPIO11/SPI_SCLK)* 24(GPIO8/SPI_~{CE0})* 26(GPIO7/SPI_~{CE1})* 27(ID_SD)* 28(ID_SC)* 29(GPIO5)* 31(GPIO6)* 32(GPIO12)* 33(GPIO13)* 35(GPIO19)* 36(GPIO16)* 37(GPIO26)* 38(GPIO20)* 40(GPIO21)*

### Library data of the parts
J11 = pi_header

## Sheet Relay_5VDC.SchDoc
size 304 x 304 mm; SheetNumber: 8; SheetTotal: 8
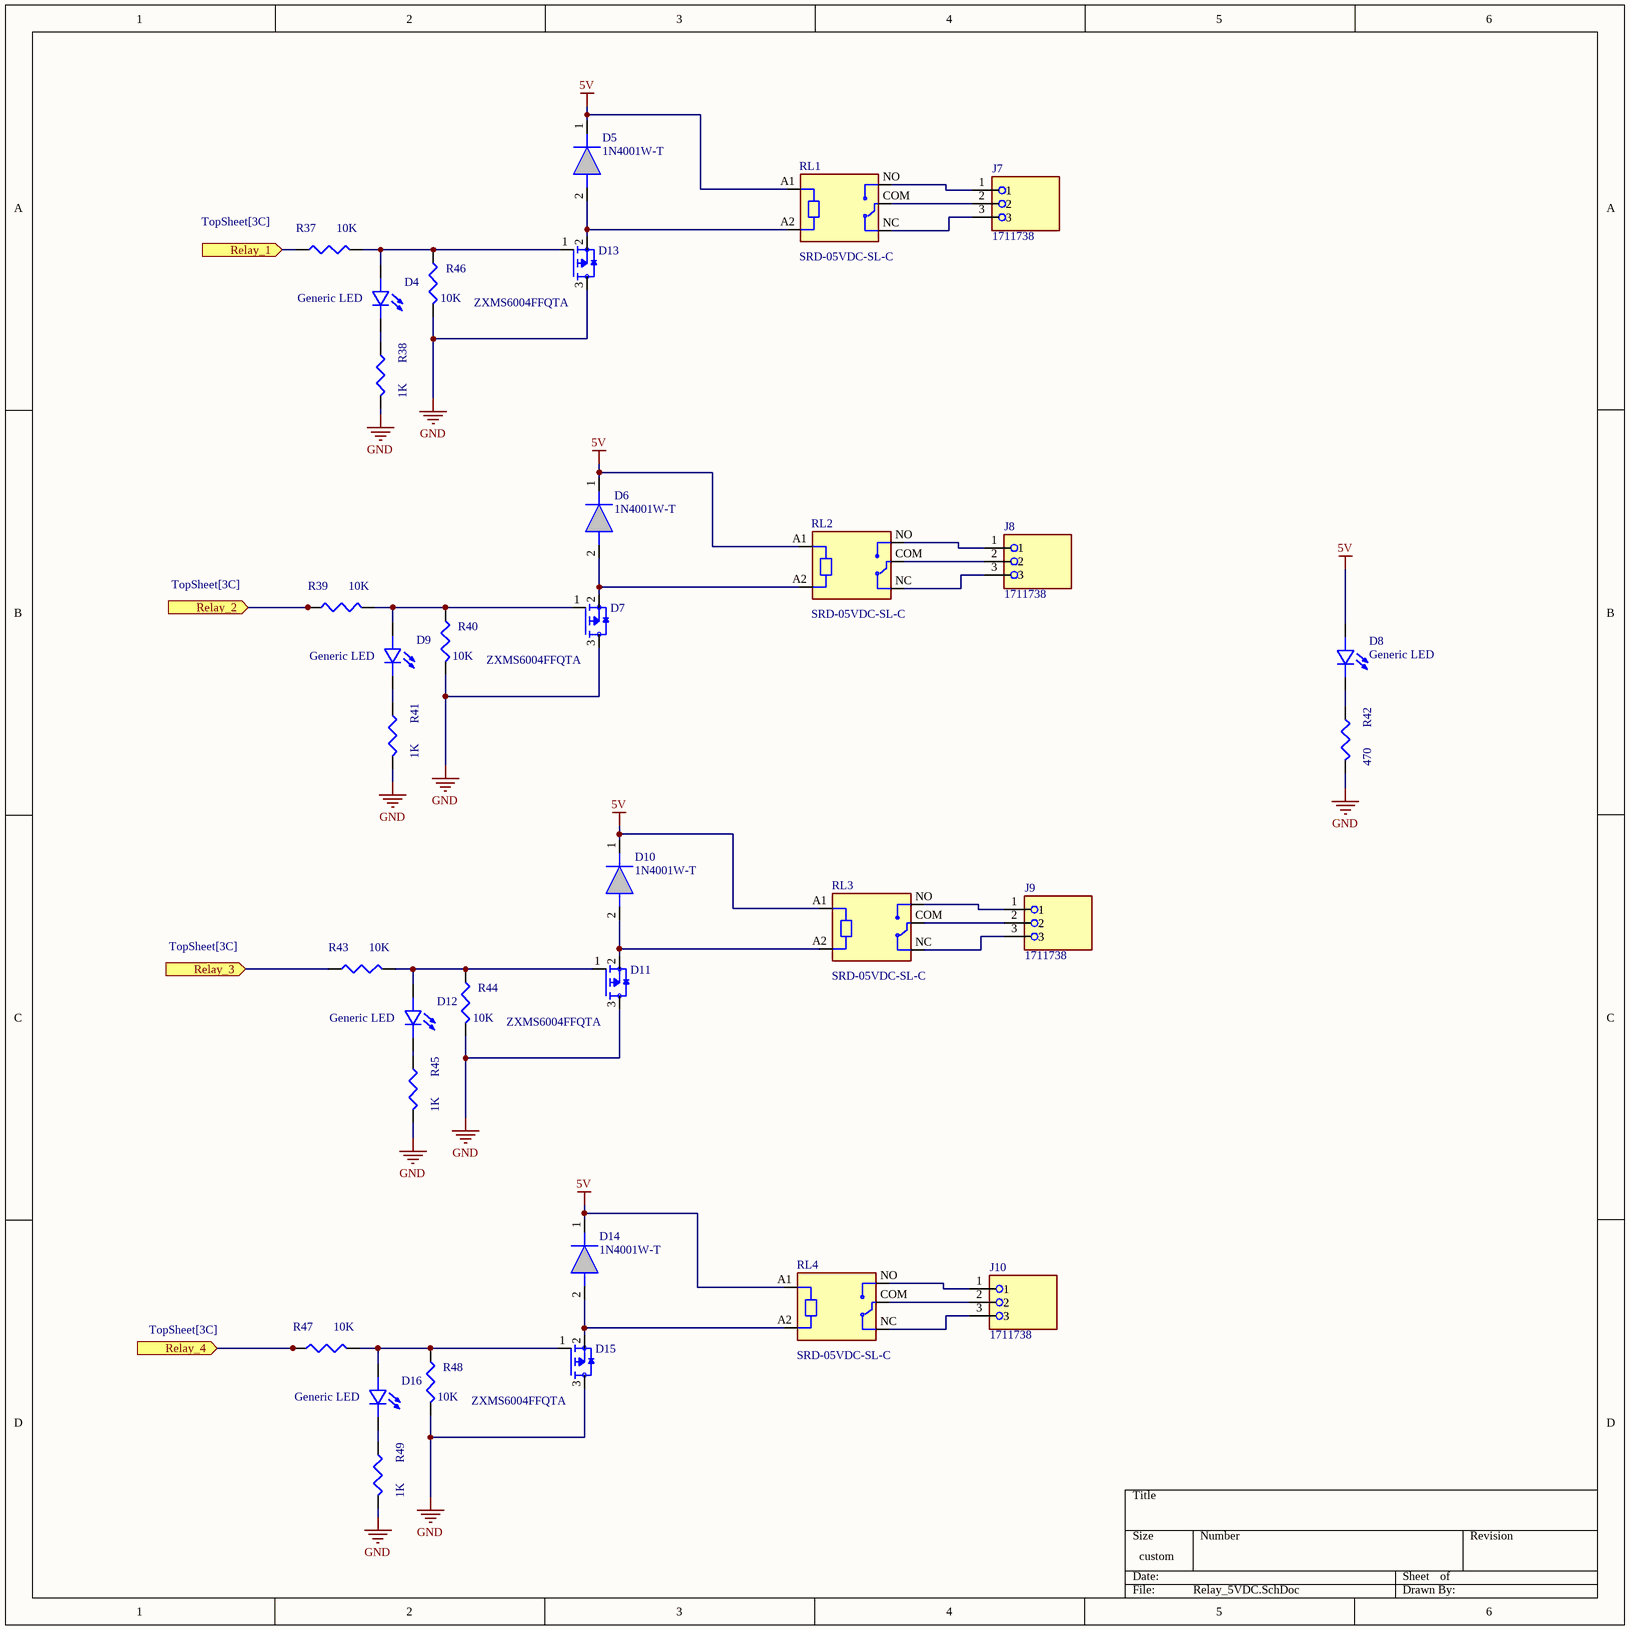
[diagram p7: Relay_5VDC.SchDoc]

### Parts
D4  Generic LED  [0603D-B]
D5  1N4001W-T  [SODFL3818X130N]
D6  1N4001W-T  [SODFL3818X130N]
D7  ZXMS6004FFQTA  [SOT95P240X100-3N]
D8  Generic LED  [0603D-B]
D9  Generic LED  [0603D-B]
D10  1N4001W-T  [SODFL3818X130N]
D11  ZXMS6004FFQTA  [SOT95P240X100-3N]
D12  Generic LED  [0603D-B]
D13  ZXMS6004FFQTA  [SOT95P240X100-3N]
D14  1N4001W-T  [SODFL3818X130N]
D15  ZXMS6004FFQTA  [SOT95P240X100-3N]
D16  Generic LED  [0603D-B]
J7  1711738  [1711738]
J8  1711738  [1711738]
J9  1711738  [1711738]
J10  1711738  [1711738]
R37  10K  [R0805]
R38  1K  [R0805]
R39  10K  [R0805]
R40  10K  [R0805]
R41  1K  [R0805]
R42  470  [R0603]
R43  10K  [R0805]
R44  10K  [R0805]
R45  1K  [R0805]
R46  10K  [R0805]
R47  10K  [R0805]
R48  10K  [R0805]
R49  1K  [R0805]
RL1  SRD-05VDC-SL-C  [SRD-05VDC-SL-C]
RL2  SRD-05VDC-SL-C  [SRD-05VDC-SL-C]
RL3  SRD-05VDC-SL-C  [SRD-05VDC-SL-C]
RL4  SRD-05VDC-SL-C  [SRD-05VDC-SL-C]

### Ports
Relay_1 (in, see TopSheet[3C]), Relay_2 (in, see TopSheet[3C]), Relay_3 (in, see TopSheet[3C]), Relay_4 (in, see TopSheet[3C])

### Nets
5V: D5.1(K) D6.1(K) D8.1(POS) D10.1(K) D14.1(K) RL1.A1 RL2.A1 RL3.A1 RL4.A1
GND: D7.3(D) D11.3(D) D13.3(D) D15.3(D) R38.2 R40.2 R41.2 R42.2 R44.2 R45.2 R46.2 R48.2 R49.2
NetD4_1: D4.1(POS) D13.1(G) R37.2 R46.1
NetD4_2: D4.2(NEG) R38.1
NetD5_2: D5.2(A) D13.2(S) RL1.A2
NetD6_2: D6.2(A) D7.2(S) RL2.A2
NetD7_1: D7.1(G) D9.1(POS) R39.2 R40.1
NetD8_2: D8.2(NEG) R42.1
NetD9_2: D9.2(NEG) R41.1
NetD10_2: D10.2(A) D11.2(S) RL3.A2
NetD11_1: D11.1(G) D12.1(POS) R43.2 R44.1
NetD12_2: D12.2(NEG) R45.1
NetD14_2: D14.2(A) D15.2(S) RL4.A2
NetD15_1: D15.1(G) D16.1(POS) R47.2 R48.1
NetD16_2: D16.2(NEG) R49.1
NetJ7_1: J7.1 RL1.NO
NetJ7_2: J7.2 RL1.COM
NetJ7_3: J7.3 RL1.NC
NetJ8_1: J8.1 RL2.NO
NetJ8_2: J8.2 RL2.COM
NetJ8_3: J8.3 RL2.NC
NetJ9_1: J9.1 RL3.NO
NetJ9_2: J9.2 RL3.COM
NetJ9_3: J9.3 RL3.NC
NetJ10_1: J10.1 RL4.NO
NetJ10_2: J10.2 RL4.COM
NetJ10_3: J10.3 RL4.NC
NetR37_1: R37.1 ; port Relay_1
NetR39_1: R39.1 ; port Relay_2
NetR43_1: R43.1 ; port Relay_3
NetR47_1: R47.1 ; port Relay_4

### Library data of the parts
D4 D8 D9 D12 D16 = LED: as D1 on sheet MCU; SnapEDA_Link: https://www.snapeda.com/parts/LHN974%20RED%20LED%201206/Osram/view-part/?ref=snap; Package: None; Value: *; Check_prices: https://www.snapeda.com/parts/LHN974%20RED%20LED%201206/Osram/view-part/?ref=eda
D5 D6 D10 D14 = 1N4001W-T: Rectifiers SOD-123,1A,50V,GP; Manufacturer_Name: Rectron; Geometry.Height: 1.3mm; Mouser Part Number: 583-1N4001W-T; Mouser Price/Stock: https://www.mouser.co.uk/ProductDetail/Rectron/1N4001W-T?qs=QNEnbhJQKvbnHIVMak28nQ%3D%3D; Manufacturer_Part_Number: 1N4001W-T; Datasheet Link: *
J7-J10 = 1711738: PCB Terminal Screw 5.08mm 12AWG 400V 24A 3 Position COMBICON MKDS Series | Phoenix Contact 1711738
R37-R49 = Resistor: as R1 on sheet TopSheet

## Nets that join several sheets
2V: Power (C26.2 U7.2), Sensors (C30.2 U10.1)
2V5: Power (C22.2 U6.5), Sensors (C31.2 U9.1)
2V8: Power (C19.2 U4.1), Sensors (C33.2 U11.1)
3V3: TopSheet (J3.01), MCU (9 pins), Power (5 pins), Sensors (12 pins), COM_LoRa (C36.2 C37.2 U12.3), COM_GSM (R28.2 R32.2)
4V: Power (5 pins), COM_GSM (6 pins)
5V: Power (18 pins), Raspberry_pi_hat (J11.2 J11.4), Relay_5VDC (9 pins)
GND: TopSheet (10 pins), MCU (9 pins), Power (31 pins), Sensors (17 pins), COM_LoRa (5 pins), COM_GSM (25 pins), Raspberry_pi_hat (8 pins), Relay_5VDC (13 pins)
V_Input: TopSheet (J1.1 J2.A9 J2.B9), Power (C7.2 C8.2 U2.1)
NetJ3_02: TopSheet (J3.02), MCU (Q2.2 R9.1)
NetJ3_03: TopSheet (J3.03), MCU (Q1.2 R10.1)
NetJ3_04: TopSheet (J3.04), MCU (U1.37)
NetJ3_05: TopSheet (J3.05), MCU (U1.36)
NetJ11_8: MCU (U1.14), Raspberry_pi_hat (J11.8)
NetJ11_10: MCU (U1.13), Raspberry_pi_hat (J11.10)
NetR12_1: MCU (U1.32), Power (R12.1 R15.2)
NetR21_1: MCU (U1.5), Sensors (R21.1 U10.5)
NetR22_1: MCU (U1.6), Sensors (R22.1 U11.5)
NetR23_1: MCU (U1.7), Sensors (R23.1 U9.5)
NetR27_1: MCU (U1.8), COM_GSM (R27.1)
NetR37_1: MCU (U1.31), Relay_5VDC (R37.1)
NetR39_1: MCU (U1.34), Relay_5VDC (R39.1)
NetR43_1: MCU (U1.35), Relay_5VDC (R43.1)
NetR47_1: MCU (U1.24), Relay_5VDC (R47.1)
NetU1_4: MCU (U1.4), COM_LoRa (U12.6)
NetU1_15: MCU (U1.15), COM_LoRa (U12.10)
NetU1_18: MCU (U1.18), COM_LoRa (U12.15)
NetU1_19: MCU (U1.19), COM_LoRa (U12.14)
NetU1_20: MCU (U1.20), COM_LoRa (U12.12)
NetU1_21: MCU (U1.21), COM_LoRa (U12.13)
NetU1_22: MCU (U1.22), COM_LoRa (U12.4)
P.06: MCU (U1.9), COM_GSM (U13.6)
P.07: MCU (U1.23), COM_GSM (U13.7)
P_SCL: MCU (R4.2 U1.17), Power (U2.2), Sensors (U8.4)
P_SDA: MCU (R5.2 U1.12), Power (U2.3), Sensors (U8.3)
RXD: MCU (U1.10), COM_GSM (Q5.3 R32.1)
TXD: MCU (U1.11), COM_GSM (Q3.3 R28.1)